# Altium schematic sheet VCO_channel.SchDoc: ADF4351 VCO
size 420 x 297 mm; Author: K.B.; CompanyName: WUT; DrawnBy: K.B.; Organization: WUT ISE; Address1: Warsaw Univeristy of Technology; Address2: Nowowiejska 15/19; DocumentNumber: 3; SheetNumber: 2; SheetTotal: 10; EDA_Number: ARTIQ; Projet: ARTIQ/SINARA; ModifiedBy: -; CreateDate: XX/XX/XXXX; CheckedDate: -; Title2: Channel; DivGrp: ISE; Designer: K.B.; ModifiedDate: -; ProjectName: ARTIQ/SINARA
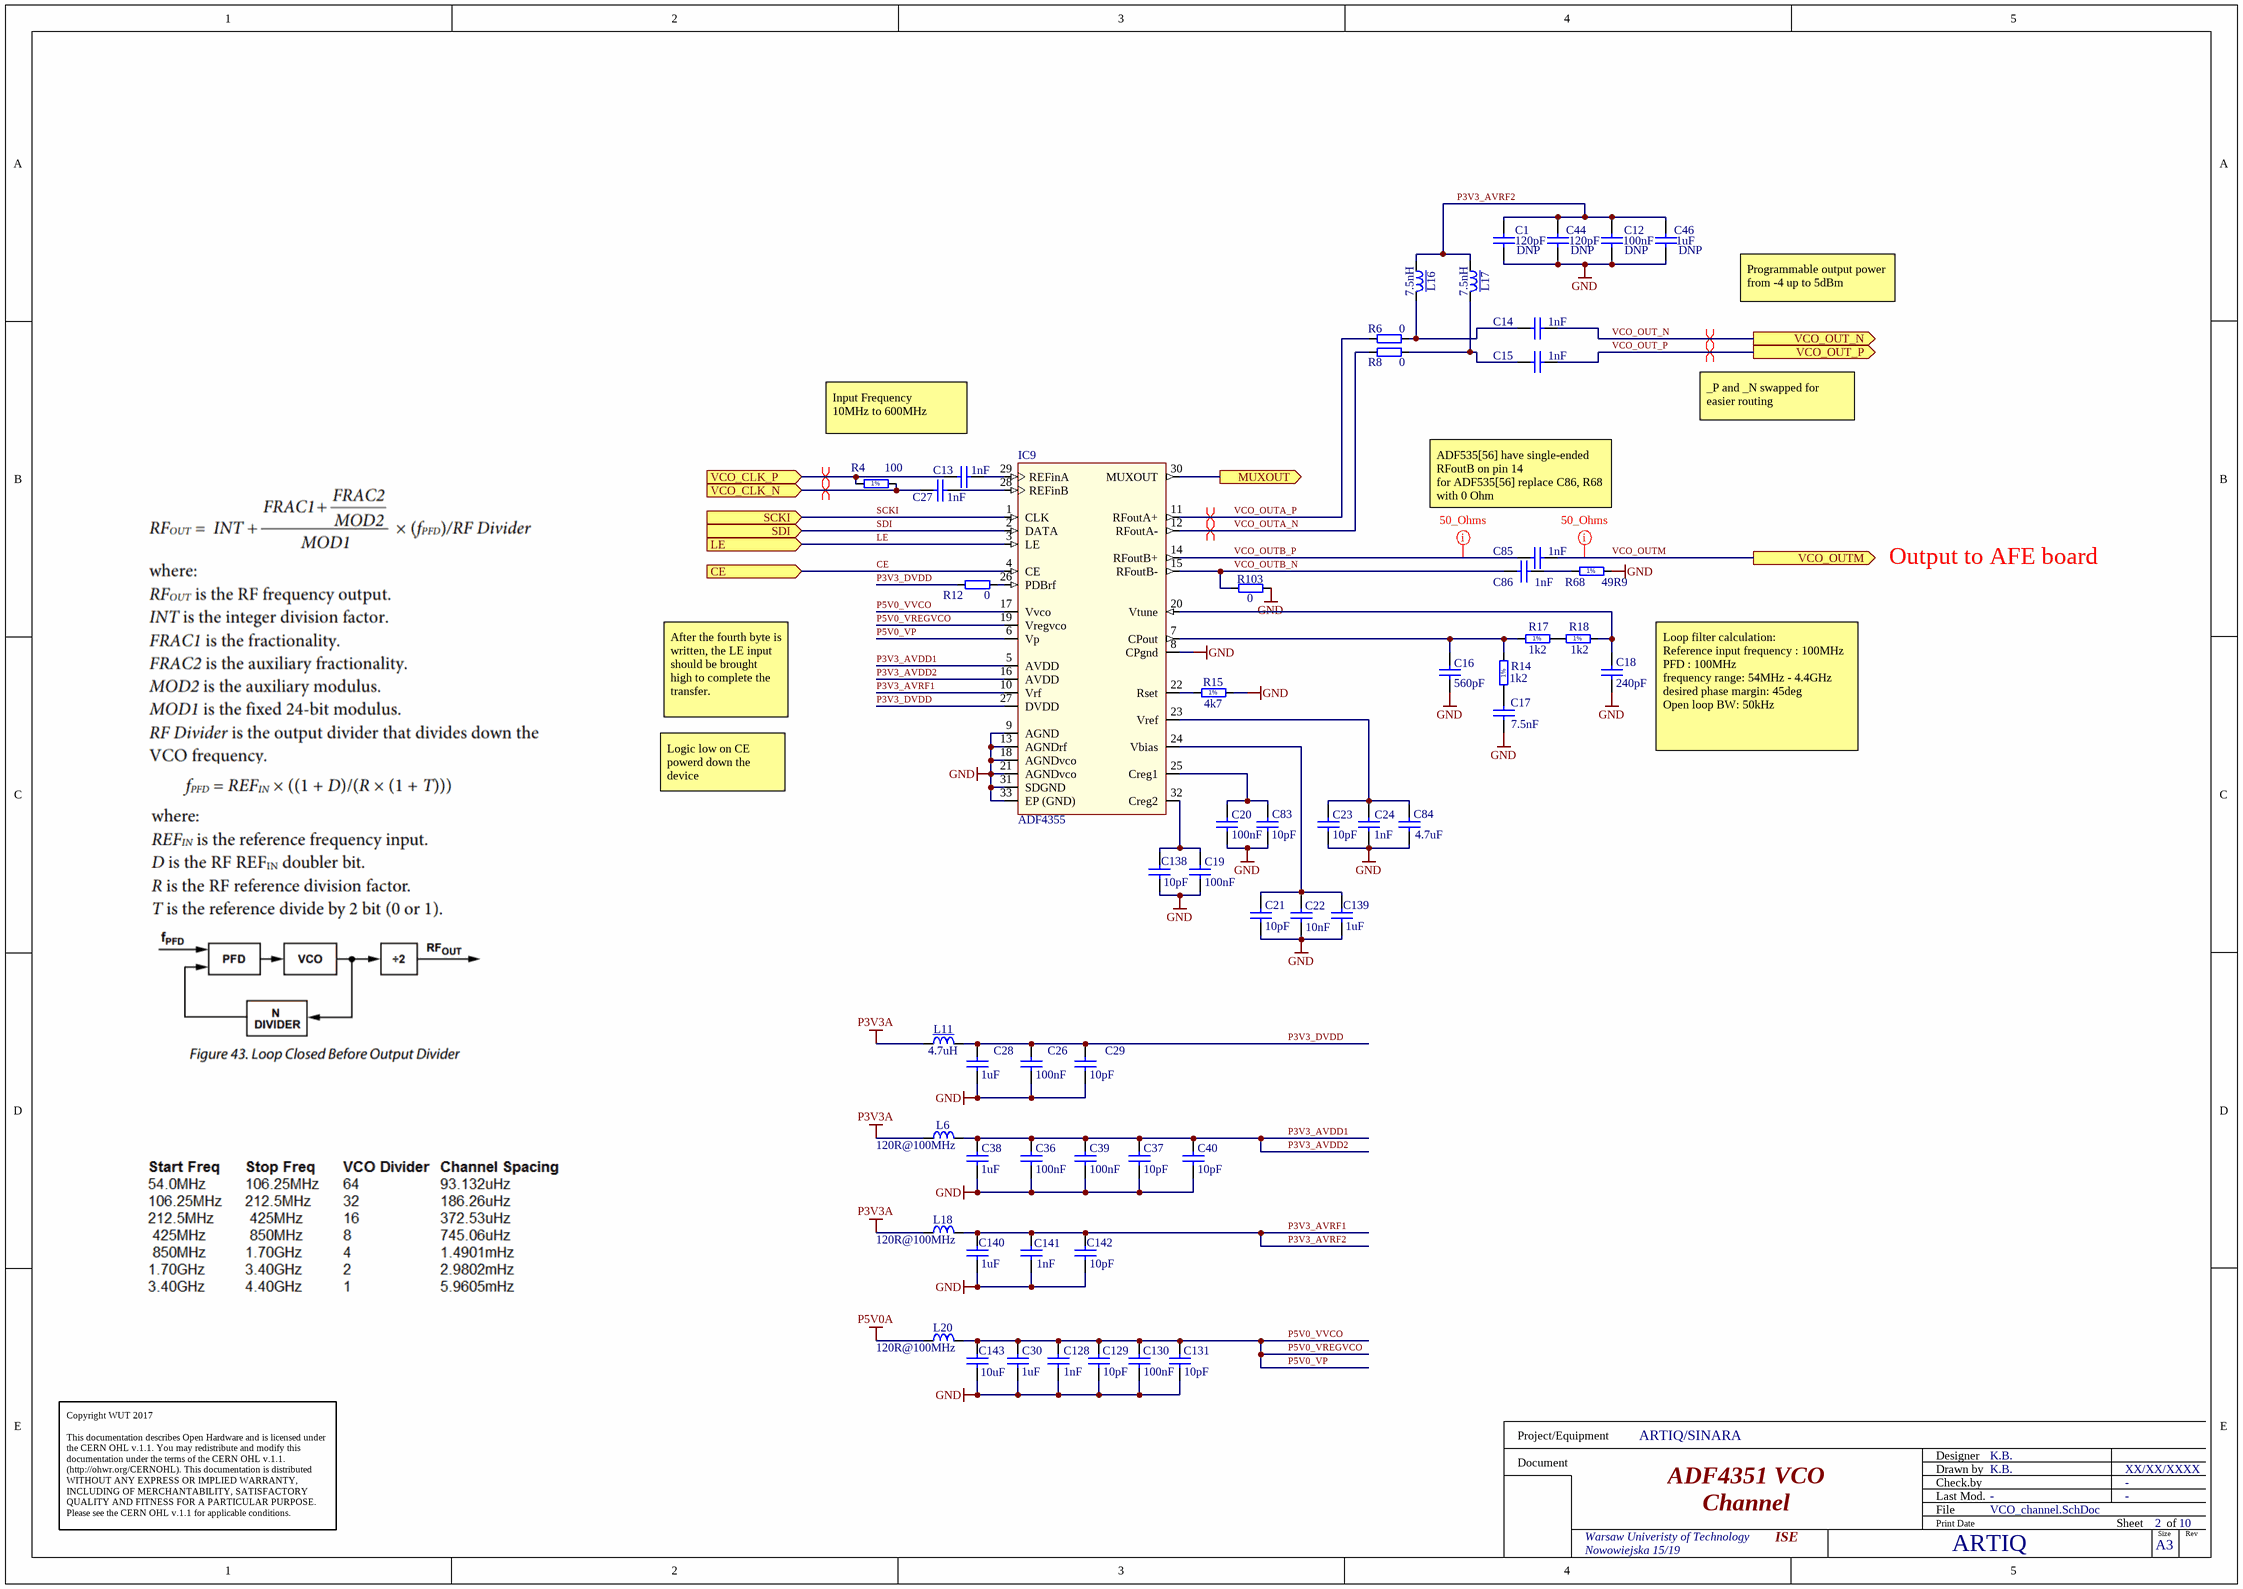
[diagram p0: VCO_channel.SchDoc]

## Parts
C1  120pF  Mounted: DNP  [CAPC1005X55N]
C12  100nF  Mounted: DNP  [CAPC1005X55N]
C13  1nF  [CAPC1005X55N]
C14  1nF  [CAPC1005X55N]
C15  1nF  [CAPC1005X55N]
C16  560pF  [CAPC1005X55N]
C17  7.5nF  [CAPC1005X55N]
C18  240pF  [CAPC1005X55N]
C19  100nF  [CAPC1005X55N]
C20  100nF  [CAPC1005X55N]
C21  10pF  [CAPC1005X55N]
C22  10nF  [CAPC1005X55N]
C23  10pF  [CAPC1005X55N]
C24  1nF  [CAPC1005X55N]
C26  100nF  [CAPC1005X55N]
C27  1nF  [CAPC1005X55N]
C28  1uF  [CAPC1005X55N]
C29  10pF  [CAPC1005X55N]
C30  1uF  [CAPC1005X55N]
C36  100nF  [CAPC1005X55N]
C37  10pF  [CAPC1005X55N]
C38  1uF  [CAPC1005X55N]
C39  100nF  [CAPC1005X55N]
C40  10pF  [CAPC1005X55N]
C44  120pF  Mounted: DNP  [CAPC1005X55N]
C46  1uF  Mounted: DNP  [CAPC1005X55N]
C83  10pF  [CAPC1005X55N]
C84  4.7uF  [CAPC1608X80N]
C85  1nF  [CAPC1005X55N]
C86  1nF  [CAPC1005X55N]
C128  1nF  [CAPC1005X55N]
C129  10pF  [CAPC1005X55N]
C130  100nF  [CAPC1005X55N]
C131  10pF  [CAPC1005X55N]
C138  10pF  [CAPC1005X55N]
C139  1uF  [CAPC1005X55N]
C140  1uF  [CAPC1005X55N]
C141  1nF  [CAPC1005X55N]
C142  10pF  [CAPC1005X55N]
C143  10uF  [CAPC1608X80N]
IC9  ADF4355  [CP-32-7_N]
L6  120R@100MHz  [INDC1608X95N]
L11  4.7uH  [INDC2012X145N]
L16  7.5nH  [IND_COILCRAFT_0402DC]
L17  7.5nH  [IND_COILCRAFT_0402DC]
L18  120R@100MHz  [INDC1608X95N]
L20  120R@100MHz  [INDC1608X95N]
R4  100  [RESC1005X40N]
R6  0  [RESC1005X40N]
R8  0  [RESC1005X40N]
R12  0  [RESC1005X40N]
R14  1k2  [RESC1005X40N]
R15  4k7  [RESC1005X40N]
R17  1k2  [RESC1005X40N]
R18  1k2  [RESC1005X40N]
R68  49R9  [RESC1005X40N]
R103  0  [RESC1005X40N]

## Ports
CE (in), LE (in), MUXOUT (out), SCKI (in), SDI (in), VCO_CLK_N (in), VCO_CLK_P (in), VCO_OUT_N (out), VCO_OUT_P (out), VCO_OUTM (out)

## Nets
GND: C1.1 C12.1 C16.1 C17.1 C18.1 C19.1 C20.1 C21.1 C22.1 C23.1 C24.1 C26.1 C28.1 C29.1 C30.1 C36.1 C37.1 C38.1 C39.1 C40.1 C44.1 C46.1 C83.1 C84.1 C128.1 C129.1 C130.1 C131.1 C138.1 C139.1 C140.1 C141.1 C142.1 C143.1 IC9.8(CPgnd) IC9.9(AGND) IC9.13(AGNDrf) IC9.18(AGNDvco) IC9.21(AGNDvco) IC9.31(SDGND) IC9.33(EP_(GND)) R15.2 R68.2 R103.2
P3V3A: L6.2 L11.1 L18.2
P5V0A: L20.2
CE: IC9.4(CE) ; port CE
LE: IC9.3(LE) ; port LE
MUXOUT: IC9.30(MUXOUT) ; port MUXOUT
P3V3_AVDD1: C36.2 C37.2 C38.2 C39.2 C40.2 IC9.5(AVDD) IC9.16(AVDD) L6.1  [also labelled P3V3_AVDD2]
P3V3_AVRF1: C1.2 C12.2 C44.2 C46.2 C140.2 C141.2 C142.2 IC9.10(Vrf) L16.1 L17.1 L18.1  [also labelled P3V3_AVRF2]
P3V3_DVDD: C26.2 C28.2 C29.2 IC9.27(DVDD) L11.2 R12.1
P5V0_VP: C30.2 C128.2 C129.2 C130.2 C131.2 C143.2 IC9.6(Vp) IC9.17(Vvco) IC9.19(Vregvco) L20.1  [also labelled P5V0_VREGVCO, P5V0_VVCO]
SCKI: IC9.1(CLK) ; port SCKI
SDI: IC9.2(DATA) ; port SDI
VCO_CLK_N: C27.1 R4.2 ; port VCO_CLK_N
VCO_CLK_P: C13.1 R4.1 ; port VCO_CLK_P
VCO_OUT_N: C14.2 ; port VCO_OUT_N
VCO_OUT_P: C15.2 ; port VCO_OUT_P
VCO_OUTA_N: IC9.12(RFoutA-) R8.1
VCO_OUTA_P: IC9.11(RFoutA+) R6.1
VCO_OUTB_N: C86.1 IC9.15(RFoutB-) R103.1
VCO_OUTB_P: C85.1 IC9.14(RFoutB+)
VCO_OUTM: C85.2 ; port VCO_OUTM
NetC13_2: C13.2 IC9.29(REFinA)
NetC14_1: C14.1 L16.2 R6.2
NetC15_1: C15.1 L17.2 R8.2
NetC16_2: C16.2 IC9.7(CPout) R14.2 R17.1
NetC17_2: C17.2 R14.1
NetC18_2: C18.2 IC9.20(Vtune) R18.2
NetC19_2: C19.2 C138.2 IC9.32(Creg2)
NetC20_2: C20.2 C83.2 IC9.25(Creg1)
NetC21_2: C21.2 C22.2 C139.2 IC9.24(Vbias)
NetC23_2: C23.2 C24.2 C84.2 IC9.23(Vref)
NetC27_2: C27.2 IC9.28(REFinB)
NetC86_2: C86.2 R68.1
NetIC9_22: IC9.22(Rset) R15.1
NetIC9_26: IC9.26(PDBrf) R12.2
NetR17_2: R17.2 R18.1

## Layout directives
differential pair; differential pair class VCO_OUT: VCO_OUT_N, VCO_OUT_P, VCO_OUTA_N, VCO_OUTA_P
differential pair: VCO_CLK_N, VCO_CLK_P
net class 50_Ohms: VCO_OUTB_P, VCO_OUTM

## Notes on the sheet
- Programmable output power from -4 up to 5dBm
- Input Frequency
  10MHz to 600MHz
- _P and _N swapped for easier routing
- ADF535[56] have single-ended RFoutB on pin 14
  for ADF535[56] replace C86, R68 with 0 Ohm
- Output to AFE board
- After the fourth byte is written, the LE input should be brought high to complete the transfer.
- Logic low on CE powerd down the device
- Loop filter calculation:
  Reference input frequency : 100MHz
  PFD : 100MHz
  frequency range: 54MHz - 4.4GHz
  desired phase margin: 45deg
  Open loop BW: 50kHz
- Copyright WUT 2017
  This documentation describes Open Hardware and is licensed under the CERN OHL v.1.1. You may redistribute and modify this documentation under the terms of the CERN OHL v.1.1. (http://ohwr.org/CERNOHL). This documentation is distributed WITHOUT ANY EXPRESS OR IMPLIED WARRANTY, INCLUDING OF MERCHANTABILITY, SATISFACTORY QUALITY AND FITNESS FOR A PARTICULAR PURPOSE. Please see the CERN OHL v.1.1 for applicable conditions.
- Project/Equipment
- Document
- Designer
- Drawn by
- Check.by
- File
- Last Mod.
- Print Date
- Sheet
- Size
- A3
- of
- Rev
- (in symbol R0402_4K7_1%_0.0625W_100PPM) 1%
- (in symbol R0402_49R9_1%_0.0625W_100PPM) 1%
- (in symbol R0402_100R_1%_0.0625W_100PPM) 1%

## Library data of the parts
C1 C44 = CC0402_10PF_50V_5%_C0G: Non-polarised capacitor; Part Number: CC0402_120PF_50V_5%_C0G; Part Description: SMD Multilayer Chip Ceramic Capacitor; Manufacturer: GENERIC; Manufacturer1 Part Number: C0402C121J5GACTU; Voltage: 50V; TC: C0G/NP0; Tolerance: ±5%; Component Kind: Standard; Component Type: Standard; Pin Count: 2; Value: 120pF; Status: Preferred; Manufacturer Part Number: CC0402_120PF_50V_5%_C0G; Case: 0402; Socket: No; SMD: Yes; Sense: No; Manufacturer1 Example: KEMET; Manufacturer1 ComponentHeight: 0.55mm; HelpURL: \\cern.ch\dfs\Applications\Altium\Datasheets\CC0805_C0G_KEMET_(Commercial Grade).pdf; Author: CERN DEM JLC; CreateDate: 2007-12-03; LatestRevisionDate: 2015-04-22
C12 C19 C20 C26 C36 C39 C130 = CC0402_100NF_16V_10%_X5R: Non-polarised capacitor; Part Description: SMD Multilayer Chip Ceramic Capacitor; Manufacturer: GENERIC; Manufacturer1 Part Number: GRM155R61C104KA88D; Voltage: 16V; TC: X5R; Tolerance: ±10%; Part Number: CC0402_100NF_16V_10%_X5R; Component Kind: Standard; Component Type: Standard; Pin Count: 2; Value: 100nF; Status: None; Manufacturer Part Number: CC0402_100NF_16V_10%_X5R; Case: 0402; Socket: No; SMD: Yes; Sense: No; Manufacturer1 Example: MURATA; Manufacturer1 ComponentHeight: 0.55mm; HelpURL: \\cern.ch\dfs\Applications\Altium\Datasheets\CC0402_X5R_MURATA_GRM.pdf; Author: CERN DEM JLC; CreateDate: 10.12.2013; LatestRevisionDate: 10.12.2013
  C19 C20 C26 C36 C39 C130: Mounted: Yes
C13-C15 C24 C27 C85 C86 C128 C141 = CC0402_1NF_50V_10%_X7R: Non-polarised capacitor; Part Description: SMD Multilayer Chip Ceramic Capacitor; Manufacturer: GENERIC; Manufacturer1 Part Number: 223858715623; Voltage: 50V; TC: X7R; Tolerance: ±10%; Part Number: CC0402_1NF_50V_10%_X7R; Component Kind: Standard; Component Type: Standard; Pin Count: 2; Value: 1nF; Status: Not Recommended; Manufacturer Part Number: CC0402_1NF_50V_10%_X7R; Case: 0402; Mounted: Yes; Socket: No; SMD: Yes; Sense: No; Manufacturer1 Example: PHYCOMP; Manufacturer1 ComponentHeight: 0.55mm; HelpURL: \\cern.ch\dfs\Applications\Altium\Datasheets\CC0402_X7R_PHYCOMP.pdf; Author: CERN DEM JLC; CreateDate: 03.12.2007; LatestRevisionDate: 03.12.2007
C16 = CC0402_10PF_50V_5%_C0G: Non-polarised capacitor; Part Number: CC0402_560PF_50V_5%_C0G; Part Description: SMD Multilayer Chip Ceramic Capacitor; Manufacturer: GENERIC; Manufacturer1 Part Number: GCM1555C1H561JA16D; Voltage: 50V; TC: C0G/NP0; Tolerance: ±5%; Component Kind: Standard; Component Type: Standard; Pin Count: 2; Value: 560pF; Status: Preferred; Manufacturer Part Number: CC0402_560PF_50V_5%_C0G; Case: 0402; Mounted: Yes; Socket: No; SMD: Yes; Sense: No; Manufacturer1 Example: Murata; Manufacturer1 ComponentHeight: 0.55mm; HelpURL: \\cern.ch\dfs\Applications\Altium\Datasheets\CC0805_C0G_KEMET_(Commercial Grade).pdf; Author: CERN DEM JLC; CreateDate: 2007-12-03; LatestRevisionDate: 2015-04-22
C17 = CC0402_10PF_50V_5%_C0G: Non-polarised capacitor; Part Number: CC0402_7N5F_25V_5%_X7R; Part Description: SMD Multilayer Chip Ceramic Capacitor; Manufacturer: GENERIC; Manufacturer1 Part Number: GRM155R71E752JA01D; Voltage: 25V; TC: X7R; Tolerance: ±5%; Component Kind: Standard; Component Type: Standard; Pin Count: 2; Value: 7.5nF; Status: Preferred; Manufacturer Part Number: CC0402_7N5F_25V_5%_X7R; Case: 0402; Mounted: Yes; Socket: No; SMD: Yes; Sense: No; Manufacturer1 Example: MURATA; Manufacturer1 ComponentHeight: 0.55mm; HelpURL: \\cern.ch\dfs\Applications\Altium\Datasheets\CC0805_C0G_KEMET_(Commercial Grade).pdf; Author: CERN DEM JLC; CreateDate: 2007-12-03; LatestRevisionDate: 2015-04-22
C18 = CC0402_10PF_50V_5%_C0G: Non-polarised capacitor; Part Number: CC0402_240PF_50V_5%_C0G; Part Description: SMD Multilayer Chip Ceramic Capacitor; Manufacturer: GENERIC; Manufacturer1 Part Number: GRM1555C1H241JA01D; Voltage: 50V; TC: C0G/NP0; Tolerance: ±5%; Component Kind: Standard; Component Type: Standard; Pin Count: 2; Value: 240pF; Status: Preferred; Manufacturer Part Number: CC0402_240PF_50V_5%_C0G; Case: 0402; Mounted: Yes; Socket: No; SMD: Yes; Sense: No; Manufacturer1 Example: MURATA; Manufacturer1 ComponentHeight: 0.55mm; HelpURL: \\cern.ch\dfs\Applications\Altium\Datasheets\CC0805_C0G_KEMET_(Commercial Grade).pdf; Author: CERN DEM JLC; CreateDate: 2007-12-03; LatestRevisionDate: 2015-04-22
C21 C23 C29 C37 C40 C83 C129 C131 C138 C142 = CC0402_10PF_50V_5%_C0G: Non-polarised capacitor; Part Description: SMD Multilayer Chip Ceramic Capacitor; Manufacturer: GENERIC; Manufacturer1 Part Number: C0402C100J5GACTU; Voltage: 50V; TC: C0G/NP0; Tolerance: ±5%; Part Number: CC0402_10PF_50V_5%_C0G; Component Kind: Standard; Component Type: Standard; Pin Count: 2; Value: 10pF; Status: Preferred; Manufacturer Part Number: CC0402_10PF_50V_5%_C0G; Case: 0402; Mounted: Yes; Socket: No; SMD: Yes; Sense: No; Manufacturer1 Example: KEMET; Manufacturer1 ComponentHeight: 0.55mm; HelpURL: \\cern.ch\dfs\Applications\Altium\Datasheets\CC0805_C0G_KEMET_(Commercial Grade).pdf; Author: CERN DEM JLC; CreateDate: 2007-12-03; LatestRevisionDate: 2015-04-22
C22 = CC0402_10NF_16V_10%_X7R: Non-polarised capacitor; Part Description: SMD Multilayer Chip Ceramic Capacitor; Manufacturer: GENERIC; Manufacturer1 Part Number: 223878715636; Voltage: 16V; TC: X7R; Tolerance: ±10%; Part Number: CC0402_10NF_16V_10%_X7R; Component Kind: Standard; Component Type: Standard; Pin Count: 2; Value: 10nF; Status: Not Recommended; Manufacturer Part Number: CC0402_10NF_16V_10%_X7R; Case: 0402; Mounted: Yes; Socket: No; SMD: Yes; Sense: No; Manufacturer1 Example: PHYCOMP; Manufacturer1 ComponentHeight: 0.55mm; HelpURL: \\cern.ch\dfs\Applications\Altium\Datasheets\CC0402_X7R_PHYCOMP.pdf; Author: CERN DEM JLC; CreateDate: 03.12.2007; LatestRevisionDate: 03.12.2007
C28 C30 C38 C46 C139 C140 = CC0402_1UF_16V_10%_X5R: Non-polarised capacitor; Part Description: SMD Multilayer Chip Ceramic Capacitor; Manufacturer: GENERIC; Manufacturer1 Part Number: C1005X5R1C105KT; Voltage: 16V; TC: X5R; Tolerance: ±10%; Part Number: CC0402_1UF_16V_10%_X5R; Component Kind: Standard; Component Type: Standard; Pin Count: 2; Value: 1uF; Status: Preferred; Manufacturer Part Number: CC0402_1UF_16V_10%_X5R; Case: 0402; Socket: No; SMD: Yes; Sense: No; Manufacturer1 Example: TDK; Manufacturer1 ComponentHeight: 0.55mm; HelpURL: \\cern.ch\dfs\Applications\Altium\Datasheets\CC0402_X5R_TDK_C.pdf; Author: CERN DEM JLC; CreateDate: 2012-10-25; LatestRevisionDate: 2012-10-25
  C28 C30 C38 C139 C140: Mounted: Yes
C84 = CC0603_10UF_16V_20%_X5R: Non-polarised capacitor; Part Number: CC0603_4U7F_16V_10%_X5R; Part Description: SMD Multilayer Chip Ceramic Capacitor; Manufacturer: GENERIC; Manufacturer1 Part Number: C1608X5R1C475K080AC; Voltage: 16V; TC: X5R; Tolerance: ±10%; Component Kind: Standard; Component Type: Standard; Pin Count: 2; Value: 4.7uF; Status: None; Manufacturer Part Number: CC0603_4U7F_16V_10%_X5R; Case: 0603; Mounted: Yes; Socket: No; SMD: Yes; Sense: No; Manufacturer1 Example: TDK; Manufacturer1 ComponentHeight: 0.8mm; HelpURL: \\cern.ch\dfs\Applications\Altium\Datasheets\CC0603_X5R_MURATA_GRM.pdf; Author: CERN DEM MR; CreateDate: 2016-03-02; LatestRevisionDate: 2016-03-02
C143 = CC0603_10UF_16V_20%_X5R: Non-polarised capacitor; Part Description: SMD Multilayer Chip Ceramic Capacitor; Manufacturer: GENERIC; Manufacturer1 Part Number: GRM188R61C106MA73D; Voltage: 16V; TC: X5R; Tolerance: ±20%; Part Number: CC0603_10UF_16V_20%_X5R; Component Kind: Standard; Component Type: Standard; Pin Count: 2; Value: 10uF; Status: None; Manufacturer Part Number: CC0603_10UF_16V_20%_X5R; Case: 0603; Mounted: Yes; Socket: No; SMD: Yes; Sense: No; Manufacturer1 Example: MURATA; Manufacturer1 ComponentHeight: 0.8mm; HelpURL: \\cern.ch\dfs\Applications\Altium\Datasheets\CC0603_X5R_MURATA_GRM.pdf; Author: CERN DEM MR; CreateDate: 2016-03-02; LatestRevisionDate: 2016-03-02
IC9 = ADF4355: 54MHz to 4400MHz Frequency Synthesizer; Manufacturer: Analog Devices; Manufacturer Part Number: ADF4355-2BCPZ; Bonding: No; PressFit: No; CreateDate: 2018-06-18; Component Type: Standard; LatestRevisionDate: 2018-06-18; Component Kind: Standard; ComponentHeight: 0.75mm; Footprint: LFCSP-32 (CP-32-7); PackageDescription: 32-Lead LFCSP (CP-32-7); ComponentLink1Description: Manufacturer Link; ComponentLink1URL: http://www.analog.com/en/prod/0%2C2877%2CAD809%2C00.html; ComponentLink2Description: Datasheet; ComponentLink2URL: http://www.analog.com/UploadedFiles/Data_Sheets/653287459AD809_a.pdf; Mounted: Yes; Part Description: 54MHz to 4400MHz Frequency Synthesizer; Part Number: ADF4355-2BCPZ; Pin Count: 32; Sense: No; SMD: Yes; Socket: No
L6 L18 L20 = IND0603_MURATA_BLM18PG121SN1D: Inductor; Part Description: SMD EMIFIL Chip Ferrite Bead; Manufacturer: MURATA; Power: 2A; Resistance: 0.05R; Part Number: IND0603_MURATA_BLM18PG121SN1D; Component Kind: Standard; Component Type: Standard; Pin Count: 2; Value: 120R@100MHz; Status: None; Manufacturer Part Number: BLM18PG121SN1D; Case: 0603; Mounted: Yes; Socket: No; SMD: Yes; Sense: No; ComponentHeight: 0.95mm; HelpURL: \\cern.ch\dfs\Applications\Altium\Datasheets\IND0603_MURATA_BLM18P.pdf; Author: CERN DEM BC; CreateDate: 2015-07-27; LatestRevisionDate: 2015-07-27
L11 = IND0805_4.7UH_20%_KEMET_L-DWI: Inductor With Core; Part Description: Wire Wound Chip Inductors; Manufacturer: KEMET; Manufacturer Part Number: L0805C4R7MDWIT; Power: 360mA; Resistance: 0.5R; Tolerance: ±20%; Part Number: IND0805_4.7UH_20%_KEMET_L-DWI; Component Kind: Standard; Component Type: Standard; Pin Count: 2; Value: 4.7uH; Status: None; Case: 0805; Mounted: Yes; Socket: No; SMD: Yes; Sense: No; ComponentHeight: 1.45mm; HelpURL: \\cern.ch\dfs\Applications\Altium\Datasheets\IND0805_KEMET_L-DWI .pdf; Author: CERN DEM JLC; CreateDate: 26.01.2010; LatestRevisionDate: 26.01.2010
L16 L17 = IND0402_7.5NH_2%_COILCRAFT_0402DC: Inductor With Core; Part Description: Ceramic Wirewound Chip Inductor, 0402DC Series; Manufacturer Part Number: 0402DC-7N5XGRW; Power: 1.65A; Resistance: 0.063R; Tolerance: ±2%; Part Number: IND0402_7.5NH_2%_COILCRAFT_0402DC; Component Kind: Standard; Component Type: Standard; Pin Count: 2; Value: 7.5nH; Status: None; Manufacturer: COILCRAFT; Case: 0402; Mounted: Yes; Socket: No; SMD: Yes; Sense: No; ComponentHeight: 0.61mm; HelpURL: \\cern.ch\dfs\Applications\Altium\Datasheets\IND0402_COILCRAFT_0402DC.pdf; Author: GK; CreateDate: 04.12.2018; LatestRevisionDate: 04.12.2018
R4 = R0402_100R_1%_0.0625W_100PPM: Resistor - 1%; Part Description: General Purpose Thick Film Chip Resistor; Manufacturer: GENERIC; Manufacturer1 Part Number: 232270671001L; TC: ±100ppm/°C; PressFit: No; Part Number: R0402_100R_1%_0.0625W_100PPM; Component Kind: Standard; Component Type: Standard; Pin Count: 2; Value: 100; Status: Not Recommended; Power: 0.0625W; Tolerance: ±1%; Manufacturer Part Number: R0402_100R_1%_0.0625W_100PPM; Case: 0402; Mounted: Yes; Sense: No; Socket: No; SMD: Yes; Manufacturer1 Example: YAGEO PHYCOMP; Manufacturer1 ComponentHeight: 0.4mm; HelpURL: \\cern.ch\dfs\Applications\Altium\Datasheets\R0402_Phycomp_RC0402.pdf; Author: CERN DEM JLC; CreateDate: 03.12.2007; LatestRevisionDate: 17.10.2012
R6 R8 R12 R103 = R0402_0R_JUMPER: Resistor; Part Description: 1A (0.05R Max DC Resistance) Zero Ohm Jumper; Manufacturer: GENERIC; Manufacturer1 Part Number: 232270591001L; PressFit: No; Part Number: R0402_0R_JUMPER; Component Kind: Standard; Component Type: Standard; Pin Count: 2; Value: 0; Status: Not Recommended; Manufacturer Part Number: R0402_0R_JUMPER; Case: 0402; Mounted: Yes; Sense: No; Socket: No; SMD: Yes; Manufacturer1 Example: YAGEO PHYCOMP; Manufacturer1 ComponentHeight: 0.4mm; HelpURL: \\cern.ch\dfs\Applications\Altium\Datasheets\R0402_Phycomp_RC0402.pdf; Author: CERN DEM JLC; CreateDate: 03.12.2007; LatestRevisionDate: 17.10.2012
R14 R17 R18 = R0402_49R9_1%_0.0625W_100PPM: Resistor - 1%; Part Number: R0402_1K2_1%_0.0625W_100PPM; Part Description: General Purpose Thick Film Chip Resistor; Manufacturer: GENERIC; Manufacturer1 Part Number: NRC04F1201TRF; TC: ±100ppm/°C; PressFit: No; Component Kind: Standard; Component Type: Standard; Pin Count: 2; Value: 1k2; Status: Preferred; Power: 0.0625W; Tolerance: ±1%; Manufacturer Part Number: R0402_1K2_1%_0.0625W_100PPM; Case: 0402; Mounted: Yes; Sense: No; Socket: No; SMD: Yes; Manufacturer1 Example: NIC COMPONENT; Manufacturer1 ComponentHeight: 0.4mm; HelpURL: \\cern.ch\dfs\Applications\Altium\Datasheets\R0402_Phycomp_RC0402.pdf; Author: CERN DEM JLC; CreateDate: 24.10.2012; LatestRevisionDate: 24.10.2012
R15 = R0402_4K7_1%_0.0625W_100PPM: Resistor - 1%; Part Description: General Purpose Thick Film Chip Resistor; Manufacturer: GENERIC; Manufacturer1 Part Number: 232270674702L; TC: ±100ppm/°C; Part Number: R0402_4K7_1%_0.0625W_100PPM; Component Kind: Standard; Component Type: Standard; Pin Count: 2; Value: 4k7; Status: Not recommended; Power: 0.0625W; Tolerance: ±1%; Manufacturer Part Number: R0402_4K7_1%_0.0625W_100PPM; Case: 0402; Mounted: Yes; Sense: No; Socket: No; SMD: Yes; Manufacturer1 Example: YAGEO PHYCOMP; Manufacturer1 ComponentHeight: 0.4mm; HelpURL: \\cern.ch\dfs\Applications\Altium\Datasheets\R0402_Phycomp_RC0402.pdf; Author: CERN DEM JLC; CreateDate: 2007-12-03; LatestRevisionDate: 2012-10-17
R68 = R0402_49R9_1%_0.0625W_100PPM: Resistor - 1%; Part Description: General Purpose Thick Film Chip Resistor; Manufacturer: GENERIC; Manufacturer1 Part Number: 232270674999L or RC0402FR-0749R9L; TC: ±100ppm/°C; PressFit: No; Part Number: R0402_49R9_1%_0.0625W_100PPM; Component Kind: Standard; Component Type: Standard; Pin Count: 2; Value: 49R9; Status: Not Recommended; Power: 0.0625W; Tolerance: ±1%; Manufacturer Part Number: R0402_49R9_1%_0.0625W_100PPM; Case: 0402; Mounted: Yes; Sense: No; Socket: No; SMD: Yes; Manufacturer1 Example: YAGEO PHYCOMP; Manufacturer1 ComponentHeight: 0.4mm; HelpURL: \\cern.ch\dfs\Applications\Altium\Datasheets\R0402_Phycomp_RC0402.pdf; Author: CERN DEM JLC; CreateDate: 24.10.2012; LatestRevisionDate: 24.10.2012